# EAGLE schematic CABLE 2 (EAGLE 9.3.0)
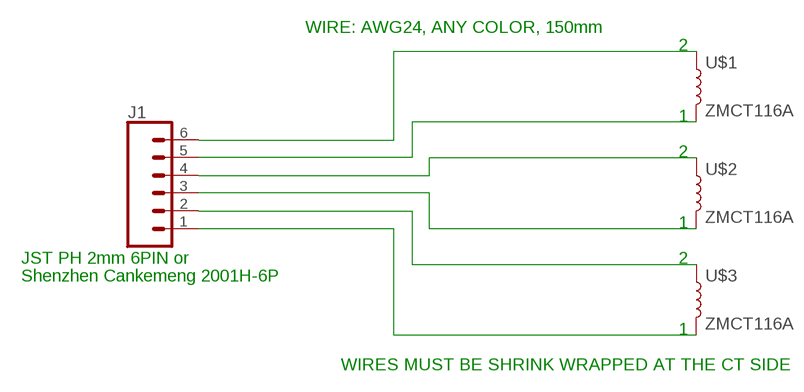
[diagram p0: schematic, sheet 1]

## Parts
J1  CONN_06LONGPADS  [1X06_LONGPADS]
U$1  ZMCT116A  [ZMCT116A]
U$2  ZMCT116A  [ZMCT116A]
U$3  ZMCT116A  [ZMCT116A]

## Nets
N$1: J1.6 U$1.P$1
N$2: J1.5 U$1.P$2
N$3: J1.4 U$2.P$1
N$4: J1.3 U$2.P$2
N$5: J1.2 U$3.P$1
N$6: J1.1 U$3.P$2

## Notes on the sheet
- WIRE: AWG24, ANY COLOR, 150mm
- 2
- 1
- 2
- 1
- JST PH 2mm 6PIN or | 2
- Shenzhen Cankemeng 2001H-6P
- 1
- WIRES MUST BE SHRINK WRAPPED AT THE CT SIDE

## Library data of the parts
J1 = SparkFun-Connectors:CONN_06: Multi connection point. Often used as Generic Header-pin footprint for 0.1 inch spaced/style header connections On any of the 0.1 inch spaced packages, you can populate with these: Break Away Headers - Straight <https://www.sparkfun.com/products/116> (PRT-00116) Break Away Male Headers - Right Angle <https://www.sparkfun.com/products/553> (PRT-00553) Female Headers <https://www.sparkfun.com/products/115> (PRT-00115) Break Away Headers - Machine Pin <https://www.sparkfun.com/products/117> (PRT-00117) Break Away Female Headers - Swiss Machine Pin <https://www.sparkfun.com/products/743> (PRT-00743) Arduino Stackable Header - 6 Pin <https://www.sparkfun.com/products/9280> (PRT-09280) For SCREWTERMINALS and SPRING TERMINALS visit here: Screw Terimnals on SparkFun.com <https://www.sparkfun.com/search/results?term=Screw+Terminals> (5mm/3.5mm/2.54mm spacing) This device is also useful as a general connection point to wire up your design to another part of your project. Our various solder wires solder well into these plated through hole pads. Hook-Up Wire - Assortment (Stranded, 22 AWG) <https://www.sparkfun.com/products/11375> (PRT-11375) Hook-Up Wire - Assortment (Solid Core, 22 AWG) <https://www.sparkfun.com/products/11367> (PRT-11367) View the entire wire category on our website here <https://www.sparkfun.com/categories/141>
U$1-U$3 = mastrogippo:ZMCT116A